# EAGLE design test subject (EAGLE 7.6.0)
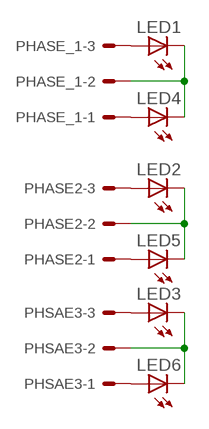
[diagram p0: schematic, sheet 1]

## Parts
LED1  LED5MM  [LED5MM]
LED2  LED5MM  [LED5MM]
LED3  LED5MM  [LED5MM]
LED4  LED5MM  [LED5MM]
LED5  LED5MM  [LED5MM]
LED6  LED5MM  [LED5MM]
PHASE2  22-27-2031-03  [6410-03]
PHASE_1  22-27-2031-03  [6410-03]
PHSAE3  22-27-2031-03  [6410-03]

## Nets
N$1: LED1.A PHASE_1.3
N$2: LED4.A PHASE_1.1
N$3: LED5.A PHASE2.1
N$4: LED2.A PHASE2.3
N$5: LED6.A PHSAE3.1
N$6: LED3.A PHSAE3.3
N$7: LED1.K(C) LED4.K(C) PHASE_1.2
N$8: LED2.K(C) LED5.K(C) PHASE2.2
N$9: LED3.K(C) LED6.K(C) PHSAE3.2

## Library data of the parts
LED1-LED6 = led:LED: LED OSRAM: - CHIPLED LG R971, LG N971, LY N971, LG Q971, LY Q971, LO R971, LY R971 LH N974, LH R974 LS Q976, LO Q976, LY Q976 LO Q996 - Hyper CHIPLED LW Q18S LB Q993, LB Q99A, LB R99A - SideLED LS A670, LO A670, LY A670, LG A670, LP A670 LB A673, LV A673, LT A673, LW A673 LH A674 LY A675 LS A676, LA A676, LO A676, LY A676, LW A676 LS A679, LY A679, LG A679 - Hyper Micro SIDELED® LS Y876, LA Y876, LO Y876, LY Y876 LT Y87S - SmartLED LW L88C, LW L88S LB L89C, LB L89S, LG L890 LS L89K, LO L89K, LY L89K LS L896, LA L896, LO L896, LY L896 - TOPLED LS T670, LO T670, LY T670, LG T670, LP T670 LSG T670, LSP T670, LSY T670, LOP T670, LYG T670 LG T671, LOG T671, LSG T671 LB T673, LV T673, LT T673, LW T673 LH T674 LS T676, LA T676, LO T676, LY T676, LB T676, LH T676, LSB T676, LW T676 LB T67C, LV T67C, LT T67C, LS T67K, LO T67K, LY T67K, LW E67C LS E67B, LA E67B, LO E67B, LY E67B, LB E67C, LV E67C, LT E67C LW T67C LS T679, LY T679, LG T679 LS T770, LO T770, LY T770, LG T770, LP T770 LB T773, LV T773, LT T773, LW T773 LH T774 LS E675, LA E675, LY E675, LS T675 LS T776, LA T776, LO T776, LY T776, LB T776 LHGB T686 LT T68C, LB T68C - Hyper Mini TOPLED® LB M676 - Mini TOPLED Santana® LG M470 LS M47K, LO M47K, LY M47K Source: http://www.osram.convergy.de LUXEON: - LUMILED® LXK2-PW12-R00, LXK2-PW12-S00, LXK2-PW14-U00, LXK2-PW14-V00 LXK2-PM12-R00, LXK2-PM12-S00, LXK2-PM14-U00 LXK2-PE12-Q00, LXK2-PE12-R00, LXK2-PE12-S00, LXK2-PE14-T00, LXK2-PE14-U00 LXK2-PB12-K00, LXK2-PB12-L00, LXK2-PB12-M00, LXK2-PB14-N00, LXK2-PB14-P00, LXK2-PB14-Q00 LXK2-PR12-L00, LXK2-PR12-M00, LXK2-PR14-Q00, LXK2-PR14-R00 LXK2-PD12-Q00, LXK2-PD12-R00, LXK2-PD12-S00 LXK2-PH12-R00, LXK2-PH12-S00 LXK2-PL12-P00, LXK2-PL12-Q00, LXK2-PL12-R00 Source: www.luxeon.com KINGBRIGHT: KA-3528ASYC Source: www.kingbright.com
PHASE2 PHASE_1 PHSAE3 = con-molex:22-?-03: CONNECTOR wire to board 2.54 mm (.1 inch) pitch header; OC_FARNELL: unknown; OC_NEWARK: unknown

## Net classes
0 default: width 0.762 mm, clearance 0.254 mm

## Board
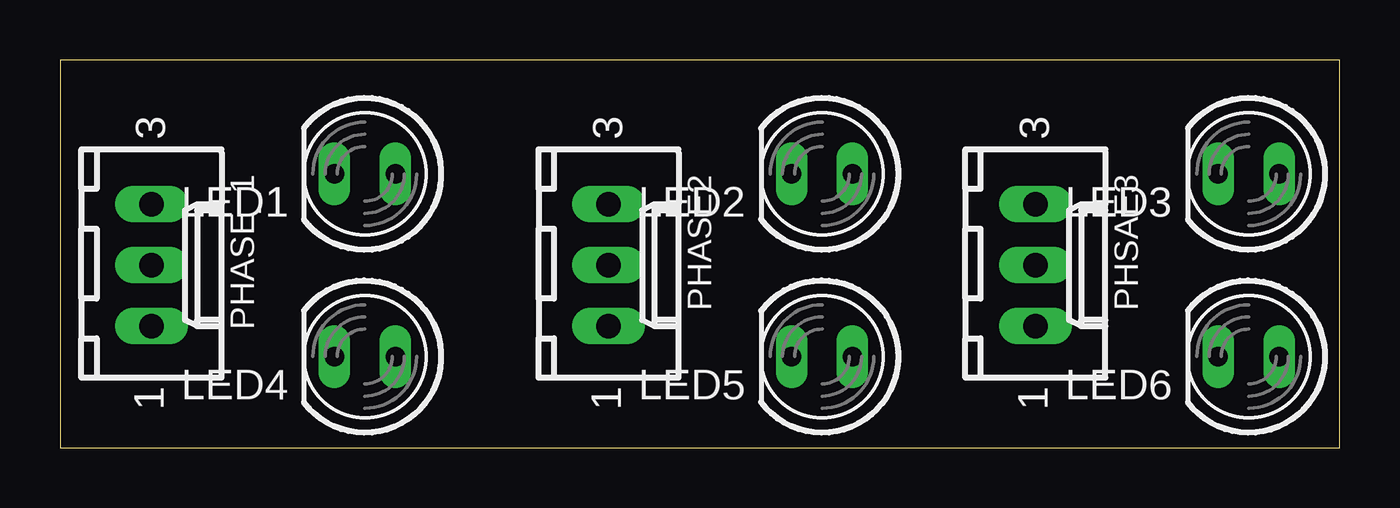
[diagram p1: board, top side]
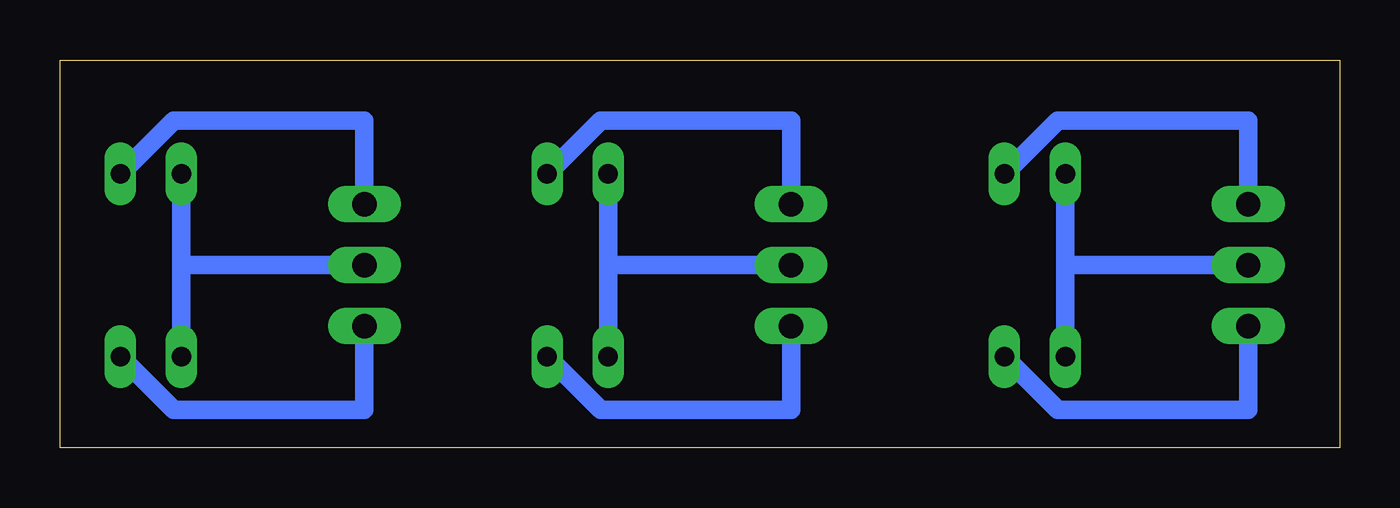
[diagram p2: board, bottom side, seen from below]

Size 53.32 x 16.18 mm. Coordinates in mm from the lower left corner, seen from the top.
Outline: 0,0 53.32,0 53.32,16.18 0,16.18 0,0
Copper layers (1*16): Top 0.035mm / dielectric 1.5mm / Bottom 0.035mm
Design rules "default": minimum track width 10mil, minimum drill 24mil, track to track 8mil, track to pad 8mil, pad to pad 8mil, via to via 8mil, smd to smd 8mil, copper to edge 40mil, drill to drill 8mil, minimum pad ring 10mil, minimum via ring 8mil, stop-mask expansion 4mil, vias tented up to drill 0mil, thermal gap 10mil

### Footprints (pad centres in the part's own frame; a part is rotated, then mirrored left to right if it is on the bottom)
LED5MM = drill 0.813 long: A -1.27,0; K 1.27,0
6410-03 = drill 1.016 long: 1 2.54,0; 2 0,0; 3 -2.54,0

### Placement (x,y rotation side)
LED1  12.7,11.43 180 top
LED2  31.75,11.43 180 top
LED3  49.53,11.43 180 top
LED4  12.7,3.81 180 top
LED5  31.75,3.81 180 top
LED6  49.53,3.81 180 top
PHASE2  22.86,7.62 270 top
PHASE_1  3.81,7.62 270 top
PHSAE3  40.64,7.62 270 top

### Tracks (layer width: path | path; a pad name or v marks a point on that pad's centre or on a via)
N$1
  Bottom 0.762: LED1.A 11.75,13.65 3.81,13.65 PHASE_1.3
N$2
  Bottom 0.762: LED4.A 11.75,1.59 3.81,1.59 PHASE_1.1
N$3
  Bottom 0.762: LED5.A 30.8,1.59 22.86,1.59 PHASE2.1
N$4
  Bottom 0.762: LED2.A 30.8,13.65 22.86,13.65 PHASE2.3
N$5
  Bottom 0.762: LED6.A 48.58,1.59 40.64,1.59 PHSAE3.1
N$6
  Bottom 0.762: LED3.A 48.58,13.65 40.64,13.65 PHSAE3.3
N$7
  Bottom 0.762: LED1.K 11.43,7.62 | 11.43,7.62 LED4.K | 11.43,7.62 PHASE_1.2
N$8
  Bottom 0.762: LED2.K 30.48,7.62 | 30.48,7.62 LED5.K | 30.48,7.62 PHASE2.2
N$9
  Bottom 0.762: LED3.K 48.26,7.62 | 48.26,7.62 LED6.K | 48.26,7.62 PHSAE3.2